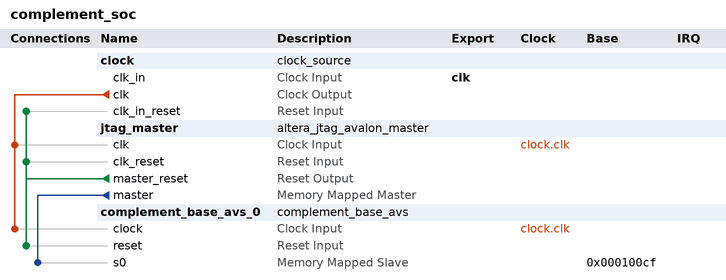
[diagram p0: system contents]
# Platform Designer (Qsys) system complement_soc, Cyclone V 5CSXFC6C6U23C8ES
# Parameters at their usual value, and those the tool derives, are not listed.
package require -exact qsys 13.1
create_system complement_soc
set_project_property DEVICE_FAMILY {Cyclone V}
set_project_property DEVICE 5CSXFC6C6U23C8ES

add_instance clock clock_source 13.1
set_instance_parameter_value clock clockFrequency 50000000

add_instance jtag_master altera_jtag_avalon_master 13.1

add_instance complement_base_avs_0 complement_base_avs 1.0

# connections
add_connection clock.clk complement_base_avs_0.clock clock
add_connection clock.clk jtag_master.clk clock
add_connection jtag_master.master_reset clock.clk_in_reset reset
add_connection jtag_master.master_reset complement_base_avs_0.reset reset
add_connection jtag_master.master_reset jtag_master.clk_reset reset
add_connection jtag_master.master complement_base_avs_0.s0 avalon
set_connection_parameter_value jtag_master.master/complement_base_avs_0.s0 baseAddress 0x000100cf

# exported interfaces
add_interface clk clock sink
set_interface_property clk EXPORT_OF clock.clk_in

set_interconnect_requirement {$system} qsys_mm.clockCrossingAdapter HANDSHAKE
set_interconnect_requirement {$system} qsys_mm.maxAdditionalLatency 1
set_interconnect_requirement {$system} qsys_mm.insertDefaultSlave false

save_system complement_soc.qsys
